# Altium schematic sheet Input.SchDoc
size A4
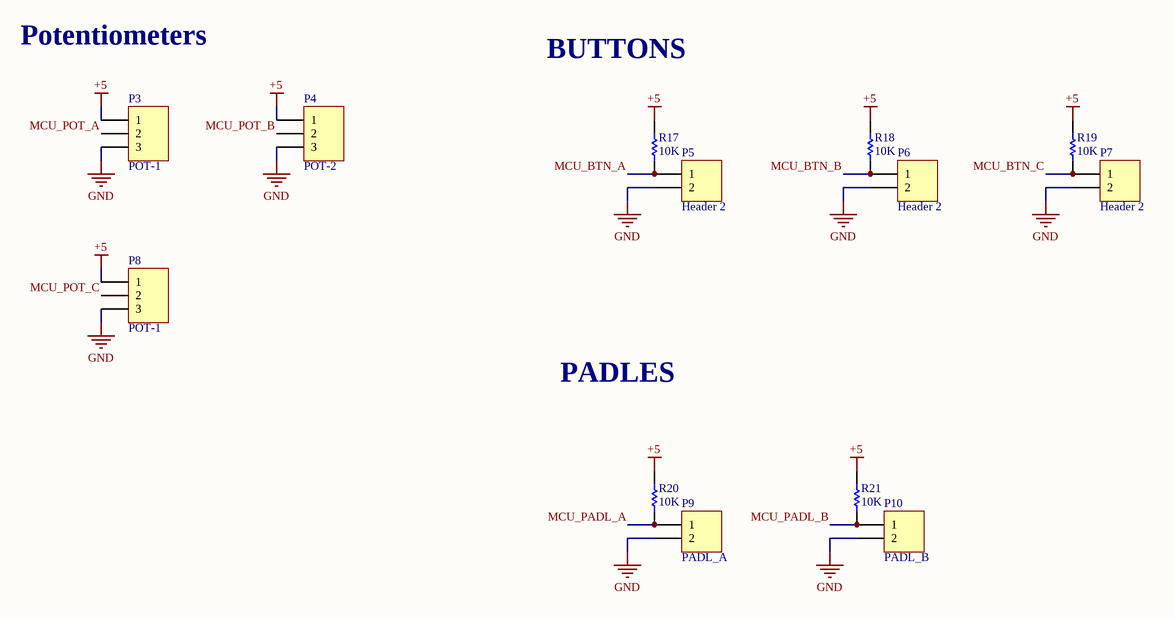
[diagram p0: Input.SchDoc]

## Parts
P3  POT-1  [HDR1X3]
P4  POT-2  [HDR1X3]
P5  Header 2  [HDR1X2]
P6  Header 2  [HDR1X2]
P7  Header 2  [HDR1X2]
P8  POT-1  [HDR1X3]
P9  PADL_A  [HDR1X2]
P10  PADL_B  [HDR1X2]
R17  10K  [RESC0603(1608)_N]
R18  10K  [RESC0603(1608)_N]
R19  10K  [RESC0603(1608)_N]
R20  10K  [RESC0603(1608)_N]
R21  10K  [RESC0603(1608)_N]

## Nets
+5: P3.1 P4.1 P8.1 R17.1 R18.1 R19.1 R20.1 R21.1
GND: P3.3 P4.3 P5.2 P6.2 P7.2 P8.3 P9.2 P10.2
MCU_BTN_A: P5.1 R17.2
MCU_BTN_B: P6.1 R18.2
MCU_BTN_C: P7.1 R19.2
MCU_PADL_A: P9.1 R20.2
MCU_PADL_B: P10.1 R21.2
MCU_POT_A: P3.2
MCU_POT_B: P4.2
MCU_POT_C: P8.2

## Notes on the sheet
- Potentiometers
- BUTTONS
- PADLES
- Title
- Size:
- Date:
- A4
- Number:
- Time:
- Revision:
- Sheet
- of
- File:

## Library data of the parts
P3 P4 P8 = Header 3: Header, 3-Pin; LatestRevisionDate: 17-Jul-2002; LatestRevisionNote: Re-released for DXP Platform.; Publisher: Altium Limited
P5-P7 P9 P10 = Header 2: Header, 2-Pin; LatestRevisionDate: 17-Jul-2002; LatestRevisionNote: Re-released for DXP Platform.; Publisher: Altium Limited
R17-R21 = CMP-1012-00098-1: 10K 0.1W 5% 0603 (1608 Metric)  SMD; Case-EIA: 0603; Value: 10000.00 Ohm; Case-Metric: 1608; Technology: SMT; Tolerance: 5 %; Power: 0.1 W